# Altium schematic sheet DigitalLabBoard_Stepper.SchDoc
size A4
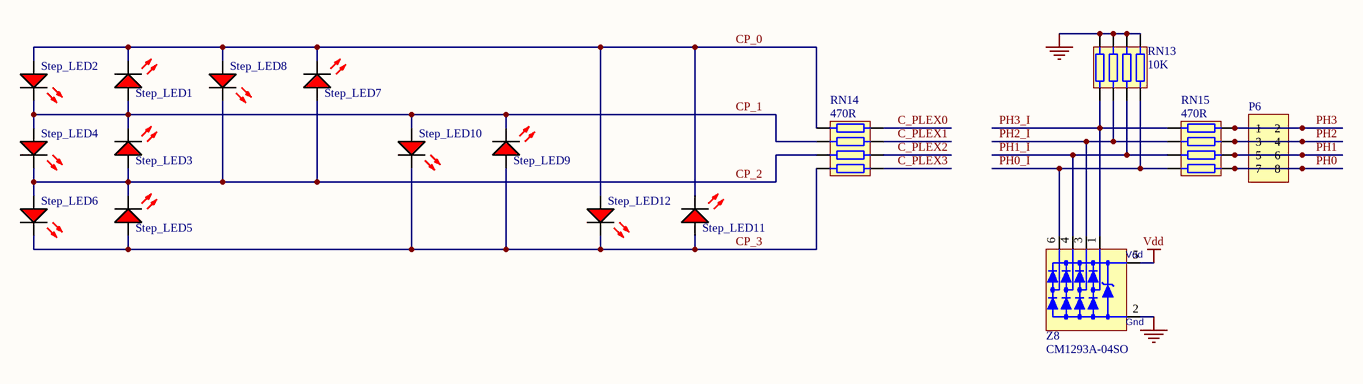
[diagram p0: DigitalLabBoard_Stepper.SchDoc]

## Parts
P6  Header 2x4  [HDR2X4S]  (value not drawn)
RN13  10K  [CR1206-0603_X4_N]
RN14  470R  [CR1206-0603_X4_N]
RN15  470R  [CR1206-0603_X4_N]
Step_LED1  LED Red  [LED1608-0603-RED]  (value not drawn)
Step_LED2  LED Red  [LED1608-0603-RED]  (value not drawn)
Step_LED3  LED Red  [LED1608-0603-RED]  (value not drawn)
Step_LED4  LED Red  [LED1608-0603-RED]  (value not drawn)
Step_LED5  LED Red  [LED1608-0603-RED]  (value not drawn)
Step_LED6  LED Red  [LED1608-0603-RED]  (value not drawn)
Step_LED7  LED Red  [LED1608-0603-RED]  (value not drawn)
Step_LED8  LED Red  [LED1608-0603-RED]  (value not drawn)
Step_LED9  LED Red  [LED1608-0603-RED]  (value not drawn)
Step_LED10  LED Red  [LED1608-0603-RED]  (value not drawn)
Step_LED11  LED Red  [LED1608-0603-RED]  (value not drawn)
Step_LED12  LED Red  [LED1608-0603-RED]  (value not drawn)
Z8  CM1293A-04SO  [SOT457_N]

## Nets
GND: RN13.1 RN13.2 RN13.3 RN13.4 Z8.2(Vn)
Vdd: Z8.5(Vp)
C_PLEX0: RN14.4
C_PLEX1: RN14.3
C_PLEX2: RN14.2
C_PLEX3: RN14.1
CP_0: RN14.5 Step_LED1.K Step_LED2.A Step_LED7.K Step_LED8.A Step_LED11.K Step_LED12.A
CP_1: RN14.6 Step_LED1.A Step_LED2.K Step_LED3.K Step_LED4.A Step_LED9.K Step_LED10.A
CP_2: RN14.7 Step_LED3.A Step_LED4.K Step_LED5.K Step_LED6.A Step_LED7.A Step_LED8.K
CP_3: RN14.8 Step_LED5.A Step_LED6.K Step_LED9.A Step_LED10.K Step_LED11.A Step_LED12.K
PH0: P6.7 P6.8 RN15.8
PH0_I: RN13.8 RN15.1 Z8.6
PH1: P6.5 P6.6 RN15.7
PH1_I: RN13.7 RN15.2 Z8.4
PH2: P6.3 P6.4 RN15.6
PH2_I: RN13.6 RN15.3 Z8.3
PH3: P6.1 P6.2 RN15.5
PH3_I: RN13.5 RN15.4 Z8.1

## Notes on the sheet
- (in symbol CM1293A-04SO) Vdd; Gnd

## Library data of the parts
RN13 = ResistorNetwork_CR0603x4: SMT x4 Resistor Array; Farnell PN: *; Digikey: *; Value: 10K; LCSC: C29718
RN14 RN15 = ResistorNetwork_CR0603x4: SMT x4 Resistor Array; Value: 470 ohm; Farnell PN: *; Digikey: *; LCSC: C25510
Step_LED1-Step_LED12 = LED-0603-Red: LED 0603 Red; Manufacturer: Generic Components; Class I: Optoelectronic; Published: 8-Jun-2000; Revision: July-2002: Re-released for DXP Platform.; Publisher: Altium Limited; Class II: LED; Farnell PN: 1581239; Digikey: *; LCSC: C2286
Z8 = CM1293A-04SO: Ultra low capacitance quadruple rail-to-rail ESD protection; Farnell PN: 2533258; Digikey: CM1293A-04SOOSCT-ND; LCSC: C393377
P6 = Header 2x4: Digikey: 609-5701-ND